# EAGLE design TeensyAcousticMappingShield (EAGLE 6.6.0)
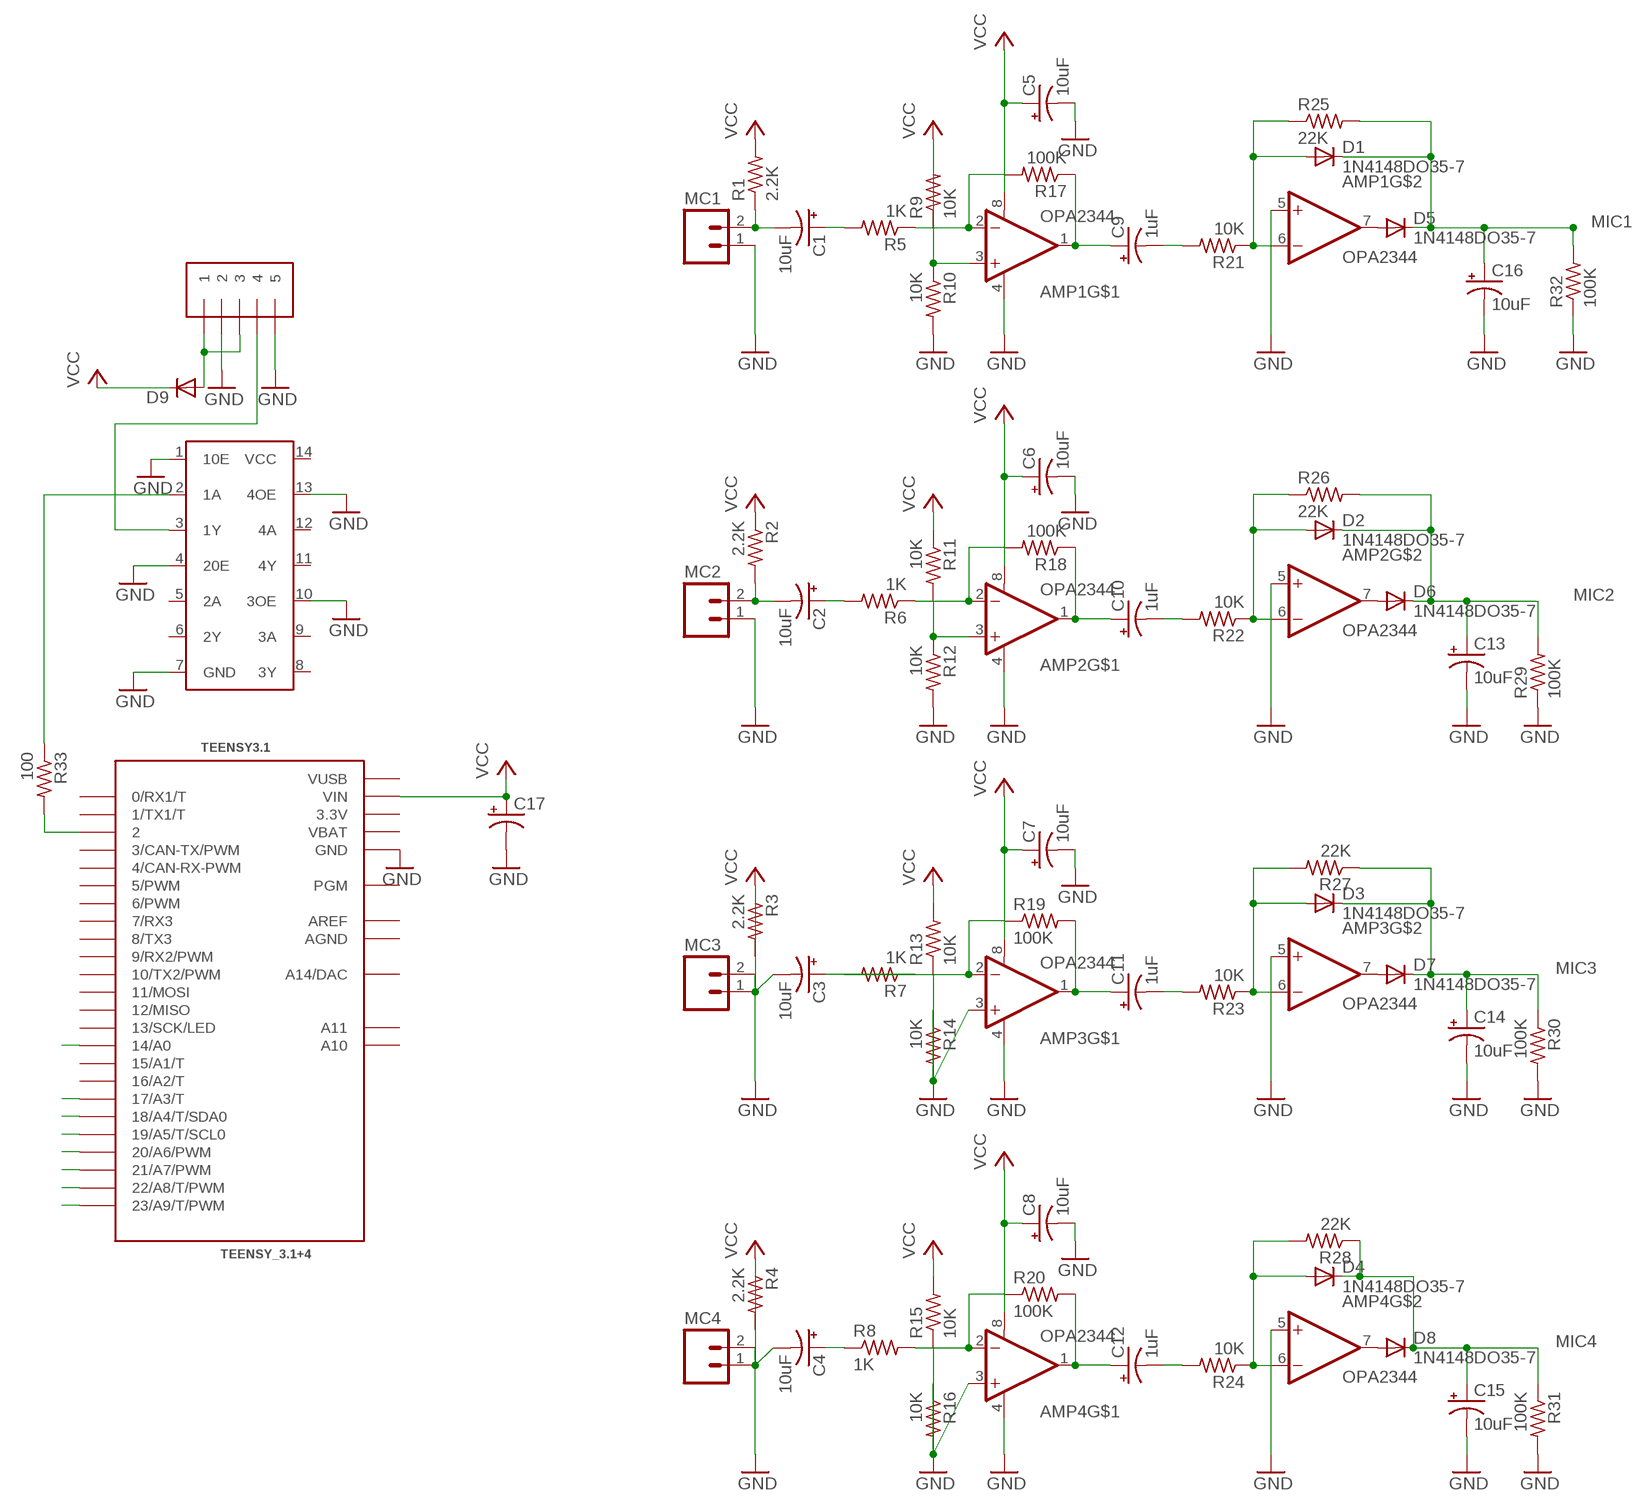
[diagram p0: schematic, sheet 1]

## Parts
AMP1  OPA2344  [DIP08]
AMP2  OPA2344  [DIP08]
AMP3  OPA2344  [DIP08]
AMP4  OPA2344  [DIP08]
C1  10uF  CPOL-USE2-4  [E2-4]
C2  10uF  CPOL-USE2-4  [E2-4]
C3  10uF  CPOL-USE2-4  [E2-4]
C4  10uF  CPOL-USE2-4  [E2-4]
C5  10uF  CPOL-USE2-4  [E2-4]
C6  10uF  CPOL-USE2-4  [E2-4]
C7  10uF  CPOL-USE2-4  [E2-4]
C8  10uF  CPOL-USE2-4  [E2-4]
C9  1uF  CPOL-USE2-4  [E2-4]
C10  1uF  CPOL-USE2-4  [E2-4]
C11  1uF  CPOL-USE2-4  [E2-4]
C12  1uF  CPOL-USE2-4  [E2-4]
C13  10uF  CPOL-USE2-4  [E2-4]
C14  10uF  CPOL-USE2-4  [E2-4]
C15  10uF  CPOL-USE2-4  [E2-4]
C16  10uF  CPOL-USE2-4  [E2-4]
C17  CPOL-USE2.5-6  [E2,5-6]
D1  1N4148DO35-7  [DO35-7]
D2  1N4148DO35-7  [DO35-7]
D3  1N4148DO35-7  [DO35-7]
D4  1N4148DO35-7  [DO35-7]
D5  1N4148DO35-7  [DO35-7]
D6  1N4148DO35-7  [DO35-7]
D7  1N4148DO35-7  [DO35-7]
D8  1N4148DO35-7  [DO35-7]
D9  DIODE-C1702-05  [C1702-05]
IO  1X5  [1X05-3.5MM]
LEVELSHIFT  74AHCT125  [DIL14]
MC1  M02LOCK_LONGPADS  [1X02_LOCK_LONGPADS]
MC2  M02LOCK_LONGPADS  [1X02_LOCK_LONGPADS]
MC3  M02LOCK_LONGPADS  [1X02_LOCK_LONGPADS]
MC4  M02LOCK_LONGPADS  [1X02_LOCK_LONGPADS]
R1  2.2K  R-US_0207/2V  [0207/2V]
R2  2.2K  R-US_0207/2V  [0207/2V]
R3  2.2K  R-US_0207/2V  [0207/2V]
R4  2.2K  R-US_0207/2V  [0207/2V]
R5  1K  R-US_0207/2V  [0207/2V]
R6  1K  R-US_0207/2V  [0207/2V]
R7  1K  R-US_0207/2V  [0207/2V]
R8  1K  R-US_0207/2V  [0207/2V]
R9  10K  R-US_0207/2V  [0207/2V]
R10  10K  R-US_0207/2V  [0207/2V]
R11  10K  R-US_0207/2V  [0207/2V]
R12  10K  R-US_0207/2V  [0207/2V]
R13  10K  R-US_0207/2V  [0207/2V]
R14  10K  R-US_0207/2V  [0207/2V]
R15  10K  R-US_0207/2V  [0207/2V]
R16  10K  R-US_0207/2V  [0207/2V]
R17  100K  R-US_0207/2V  [0207/2V]
R18  100K  R-US_0207/2V  [0207/2V]
R19  100K  R-US_0207/2V  [0207/2V]
R20  100K  R-US_0207/2V  [0207/2V]
R21  10K  R-US_0207/2V  [0207/2V]
R22  10K  R-US_0207/2V  [0207/2V]
R23  10K  R-US_0207/2V  [0207/2V]
R24  10K  R-US_0207/2V  [0207/2V]
R25  22K  R-US_0207/2V  [0207/2V]
R26  22K  R-US_0207/2V  [0207/2V]
R27  22K  R-US_0207/2V  [0207/2V]
R28  22K  R-US_0207/2V  [0207/2V]
R29  100K  R-US_0207/2V  [0207/2V]
R30  100K  R-US_0207/2V  [0207/2V]
R31  100K  R-US_0207/2V  [0207/2V]
R32  100K  R-US_0207/2V  [0207/2V]
R33  100  R-US_0207/2V  [0207/2V]
TEENSY3.1  TEENSY_3.1+4  [TEENSY_3.1+4]

## Nets
B+: D9.A IO.1 IO.3
GND: AMP1.4(V-) AMP1.5(+IN) AMP2.4(V-) AMP2.5(+IN) AMP3.4(V-) AMP3.5(+IN) AMP4.4(V-) AMP4.5(+IN) C5.- C6.- C7.- C8.- C13.- C14.- C15.- C16.- C17.- IO.2 IO.5 LEVELSHIFT.1(10E) LEVELSHIFT.4(20E) LEVELSHIFT.7(GND) LEVELSHIFT.10(3OE) LEVELSHIFT.13(4OE) MC1.1 MC2.1 MC3.2 MC4.2 R10.2 R12.2 R14.1 R16.1 R29.1 R32.1 TEENSY3.1.GND TEENSY3.1.GND1(GND)
MIC1: C16.+ D1.C D5.C R25.2 R32.2 TEENSY3.1.14/A0
MIC2: C13.+ D2.C D6.C R26.2 R29.2 TEENSY3.1.17/A3(17/A3/T)
MIC3: C14.+ D3.C D7.C R27.1 R30.1 TEENSY3.1.18/A4(18/A4/T/SDA0)
MIC4: C15.+ D4.C D8.C R28.1 R31.1 TEENSY3.1.19/A5(19/A5/T/SCL0)
N$1: AMP1.3(+IN) R9.2 R10.1
N$2: AMP1.2(-IN) R5.1 R17.2
N$3: AMP1.1(OUT) C9.+ R17.1
N$4: C1.+ R5.2
N$5: C1.- MC1.2 R1.1
N$6: C9.- R21.2
N$7: AMP1.6(-IN) D1.A R21.1 R25.1
N$8: AMP1.7(OUT) D5.A
N$9: AMP2.3(+IN) R11.2 R12.1
N$10: AMP2.2(-IN) R6.1 R18.2
N$11: AMP2.1(OUT) C10.+ R18.1
N$12: C2.+ R6.2
N$13: C2.- MC2.2 R2.2
N$14: C10.- R22.2
N$15: AMP2.6(-IN) D2.A R22.1 R26.1
N$16: AMP2.7(OUT) D6.A
N$17: AMP3.3(+IN) R13.1 R14.2
N$18: R33.2 TEENSY3.1.2
N$19: LEVELSHIFT.2(1A) R33.1
N$20: TEENSY3.1.20/A6(20/A6/PWM)
N$21: TEENSY3.1.21/A7(21/A7/PWM)
N$22: TEENSY3.1.22/A8(22/A8/T/PWM)
N$23: TEENSY3.1.23/A9(23/A9/T/PWM)
N$24: AMP3.2(-IN) R7.2 R19.1
N$25: AMP3.1(OUT) C11.+ R19.2
N$26: C3.+ R7.1
N$27: C3.- MC3.1 R3.1
N$28: C11.- R23.2
N$29: AMP3.6(-IN) D3.A R23.1 R27.2
N$30: AMP3.7(OUT) D7.A
N$31: AMP4.3(+IN) R15.1 R16.2
N$32: AMP4.2(-IN) R8.2 R20.1
N$33: AMP4.1(OUT) C12.+ R20.2
N$34: C4.+ R8.1
N$35: C4.- MC4.1 R4.1
N$36: C12.- R24.2
N$37: AMP4.6(-IN) D4.A R24.1 R28.2
N$38: AMP4.7(OUT) D8.A
N$41: IO.4 LEVELSHIFT.3(1Y)
VCC: AMP1.8(V+) AMP2.8(V+) AMP3.8(V+) AMP4.8(V+) C5.+ C6.+ C7.+ C8.+ C17.+ D9.C R1.2 R2.1 R3.2 R4.2 R9.1 R11.1 R13.2 R15.2 TEENSY3.1.VIN
Unconnected: LEVELSHIFT.5(2A) LEVELSHIFT.6(2Y) LEVELSHIFT.8(3Y) LEVELSHIFT.9(3A) LEVELSHIFT.11(4Y) LEVELSHIFT.12(4A) LEVELSHIFT.14(VCC) R30.2 R31.2 TEENSY3.1.0(0/RX1/T) TEENSY3.1.1(1/TX1/T) TEENSY3.1.3(3/CAN-TX/PWM) TEENSY3.1.4(4/CAN-RX-PWM) TEENSY3.1.5(5/PWM) TEENSY3.1.6(6/PWM) TEENSY3.1.7(7/RX3) TEENSY3.1.8(8/TX3) TEENSY3.1.9(9/RX2/PWM) TEENSY3.1.10(10/TX2/PWM) TEENSY3.1.11(11/MOSI) TEENSY3.1.12(12/MISO) TEENSY3.1.13(13/SCK/LED) TEENSY3.1.15/A1(15/A1/T) TEENSY3.1.16/A2(16/A2/T) TEENSY3.1.A10 TEENSY3.1.A11 TEENSY3.1.A14(A14/DAC) TEENSY3.1.PGM

## Power pins joined to a net without a drawn wire
3.3V: TEENSY3.1.3.3V TEENSY3.1.3.3V1(3.3V)
AGND: TEENSY3.1.AGND
AREF: TEENSY3.1.AREF
VBAT: TEENSY3.1.VBAT
VUSB: TEENSY3.1.VUSB

## Library data of the parts
AMP1-AMP4 = AcousticMappingParts:OPA2344: BurrBrown OPAmp
C1-C16 = resistor:CPOL-US: POLARIZED CAPACITOR, American symbol
C17 = adafruit:CPOL-US: POLARIZED CAPACITOR, American symbol
D1-D8 = diode:1N4148: DIODE high speed (Philips)
D9 = diode:DIODE-: DIODE
IO = adafruit:1X5
LEVELSHIFT = AcousticMappingParts:74AHCT125
MC1-MC4 = SparkFun-Connectors:M02: Header 2 Standard 2-pin 0.1" header. Use with straight break away headers (SKU : PRT-00116), right angle break away headers (PRT-00553), swiss pins (PRT-00743), machine pins (PRT-00117), and female headers (PRT-00115). Molex polarized connector foot print use with SKU : PRT-08233 with associated crimp pins and housings.
R1-R33 = adafruit:R-US_: RESISTOR, American symbol
TEENSY3.1 = Teensy_3_Series_Board_v1.0:TEENSY_3.1+4: Footprint for Teensy 3.1 board using all through-holes, i.e. the entire perimeter plus the 4 through-holes inboard (A10,A11,AREF, VUSB)

## Board
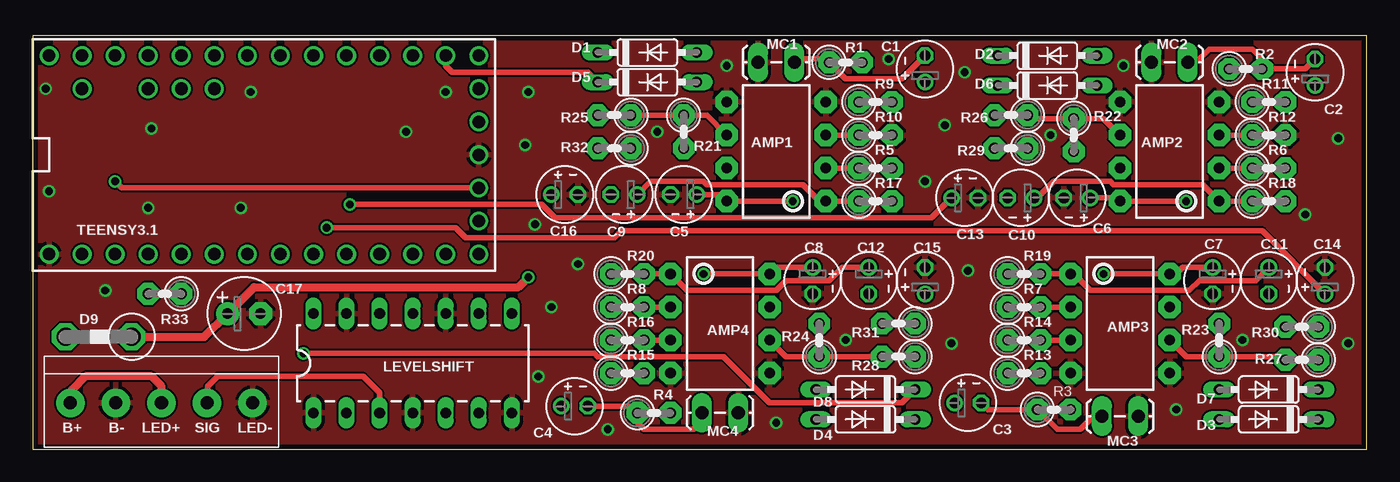
[diagram p1: board, top side]
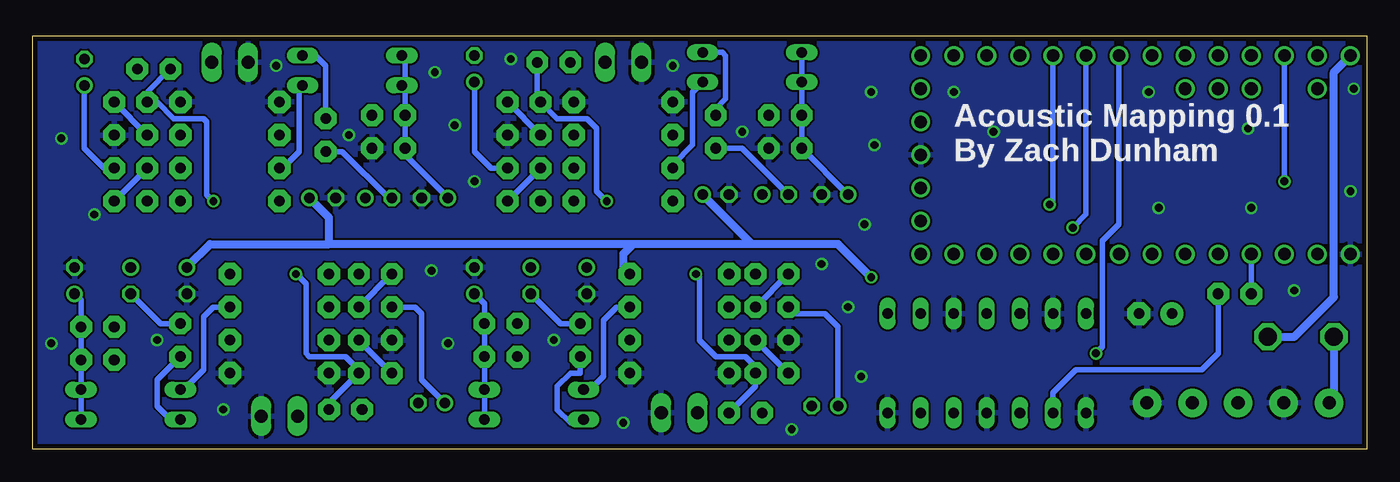
[diagram p2: board, bottom side, seen from below]

Size 102.54 x 31.75 mm. Coordinates in mm from the lower left corner, seen from the top.
Outline: 0,0 102.54,0 102.54,31.74 0.01,31.75 0,0
Copper layers (1*16): Top 0.0356mm / dielectric 1.5011mm / Bottom 0.0356mm
Design rules "OSHDRU": minimum track width 6mil, minimum drill 13mil, track to track 6mil, track to pad 6mil, pad to pad 6mil, via to via 6mil, smd to smd 6mil, copper to edge 15mil, drill to drill 6mil, minimum pad ring 7mil, minimum via ring 7mil, stop-mask expansion 3mil, vias tented up to drill 0mil, thermal gap 10mil

### Footprints (pad centres in the part's own frame; a part is rotated, then mirrored left to right if it is on the bottom)
DIP08 = drill 0.813 pad 1.727 octagon: 1 -3.81,-3.81; 2 -1.27,-3.81; 3 1.27,-3.81; 4 3.81,-3.81; 5 3.81,3.81; 6 1.27,3.81; 7 -1.27,3.81; 8 -3.81,3.81
E2-4 = drill 0.813 pad 1.27: + -1.016,0 | drill 0.813 pad 1.27 octagon: - 1.016,0
E2,5-6 = drill 0.813 pad 1.778: + -1.27,0 | drill 0.813 pad 1.778 octagon: - 1.27,0
DO35-7 = drill 0.813 long: A 3.81,0; C -3.81,0
C1702-05 = drill 1.397 octagon: A 2.54,0; C -2.54,0
1X05-3.5MM = drill 1 pad 2.184: 1 7,0; 2 3.5,0; 3 0,0; 4 -3.5,0; 5 -7,0
DIL14 = drill 0.813 long: 1 -8.89,-3.81; 2 -6.35,-3.81; 3 -3.81,-3.81; 4 -1.27,-3.81; 5 1.27,-3.81; 6 3.81,-3.81; 7 6.35,-3.81; 8 6.35,3.81; 9 3.81,3.81; 10 1.27,3.81; 11 -1.27,3.81; 12 -3.81,3.81; 13 -6.35,3.81; 14 -8.89,3.81
1X02_LOCK_LONGPADS = drill 1.016 long: 1 -0.127,0; 2 2.667,0
0207/2V = drill 0.813 pad 1.676 octagon: 1 -1.27,0; 2 1.27,0
TEENSY_3.1+4 = drill 0.965: 0 -7.62,15.24; 1 -7.62,12.7; 2 -7.62,10.16; 3 -7.62,7.62; 3.3V 7.62,12.7; 3.3V1 -2.54,-15.24; 4 -7.62,5.08; 5 -7.62,2.54; 6 -7.62,0; 7 -7.62,-2.54; 8 -7.62,-5.08; 9 -7.62,-7.62; 10 -7.62,-10.16; 11 -7.62,-12.7; 12 -7.62,-15.24; 13 7.62,-15.24; 14/A0 7.62,-12.7; 15/A1 7.62,-10.16; 16/A2 7.62,-7.62; 17/A3 7.62,-5.08; 18/A4 7.62,-2.54; 19/A5 7.62,0; 20/A6 7.62,2.54; 21/A7 7.62,5.08; 22/A8 7.62,7.62; 23/A9 7.62,10.16; A10 5.08,7.62; A11 5.08,5.08; A14 5.08,-15.24; AGND 7.62,15.24; AREF 5.08,10.16; GND -7.62,17.78; GND1 0,-15.24; PGM 2.54,-15.24; VBAT -5.08,-15.24; VIN 7.62,17.78; VUSB 5.08,15.24

### Placement (x,y rotation side)
AMP1  57.15,22.86 90 top
AMP2  87.38,22.86 90 top
AMP3  83.57,9.65 270 top
AMP4  52.83,9.65 270 top
C1  68.58,29.21 90 top
C2  98.55,28.96 90 top
C3  71.88,3.56 0 top
C4  41.66,3.3 0 top
C5  50.04,19.56 180 top
C6  80.26,19.3 180 top
C7  90.68,12.95 270 top
C8  59.94,12.95 270 top
C9  45.47,19.56 180 top
C10  75.95,19.3 180 top
C11  95,12.95 270 top
C12  64.26,12.95 270 top
C13  71.63,19.3 0 top
C14  99.31,12.95 90 top
C15  68.58,12.95 90 top
C16  40.89,19.56 0 top
C17  16.26,10.41 0 top
D1  47.24,30.48 0 top
D2  77.98,30.23 0 top
D3  95,2.29 180 top
D4  64.01,2.29 180 top
D5  47.24,28.19 0 top
D6  77.98,27.94 0 top
D7  95,4.57 180 top
D8  64.01,4.57 180 top
D9  5.08,8.64 180 top
IO  9.91,3.56 180 top
LEVELSHIFT  30.48,6.6 0 top
MC1  55.88,29.72 0 top
MC2  86.11,29.72 0 top
MC3  82.3,2.54 0 top
MC4  51.56,2.79 0 top
R1  62.48,29.72 0 top
R2  93.22,29.21 0 top
R3  78.49,3.05 0 top
R4  47.75,2.79 0 top
R5  64.77,21.59 0 top
R6  95,21.59 0 top
R7  76.2,10.92 0 top
R8  45.72,10.92 0 top
R9  64.77,26.67 0 top
R10  64.77,24.13 0 top
R11  95,26.67 0 top
R12  95,24.13 0 top
R13  76.2,5.84 0 top
R14  76.2,8.38 0 top
R15  45.72,5.84 0 top
R16  45.72,8.38 0 top
R17  64.77,19.05 0 top
R18  95,19.05 0 top
R19  76.2,13.46 0 top
R20  45.72,13.46 0 top
R21  50.04,24.38 270 top
R22  80.01,24.13 270 top
R23  91.19,8.38 90 top
R24  60.45,8.38 90 top
R25  44.7,25.65 180 top
R26  75.18,25.65 180 top
R27  97.54,6.86 180 top
R28  66.55,7.11 180 top
R29  75.18,23.11 180 top
R30  97.54,9.4 180 top
R31  66.55,9.65 180 top
R32  44.7,23.11 180 top
R33  10.16,11.94 180 top
TEENSY3.1  19.05,22.61 90 top

### Tracks (layer width: path | path; a pad name or v marks a point on that pad's centre or on a via)
3.3V  (via drill 0.6)
  Top 0.406: TEENSY3.1.3.3V1 6.86,20.07 v6.35,20.57
  Bottom 0.406: v6.35,20.57 TEENSY3.1.3.3V
B+
  Top 0.61: IO.3 9.91,4.83 9.14,5.59 4.06,5.59 3.05,4.57 3.05,3.7 IO.1
  Bottom 0.61: D9.A 2.54,3.92 IO.1
GND  (via drill 0.6)
  other vias: 65.79,29.97 70.1,24.89 68.58,20.57 71.88,13.72 70.61,8.13 100.33,23.88 97.79,18.03 38.61,17.27 41.91,14.22 38.86,5.59 39.88,10.92 37.85,23.37 38.1,27.43 31.75,27.43 28.7,24.38 16.76,27.43 1.02,27.69 1.27,19.81 9.14,24.64 8.89,18.54 16,18.54 5.59,12.19 87.88,3.05 101.09,8.13 83.82,29.46 53.34,29.46 48.01,24.38 78.23,24.13 92.96,8.38 62.48,8.38 57.15,2.03 44.2,1.52 71.63,28.96
  pour Top: 0,0.25 102.62,0.51 102.62,32 0,31.75
  pour Bottom: 0,0.25 102.62,0.51 102.62,32 0,31.75
MIC1
  Top 0.406: TEENSY3.1.14/A0 31.75,29.46 32.26,28.96 42.67,28.96 D5.C
  Bottom 0.406: D1.C D5.C R25.2 R32.2 C16.+
MIC2  (via drill 0.6)
  Top 0.406: C13.+ 69.09,17.78 40.13,17.78 39.12,18.8 33.78,18.8 33.27,18.8 v24.38,18.8
  Bottom 0.406: 73.91,28.19 R26.2 R29.2 73.91,22.61 C13.+ | D2.C 73.91,29.97 73.91,28.19 | 73.91,28.19 D6.C | TEENSY3.1.17/A3 24.13,19.05 v24.38,18.8
MIC3  (via drill 0.6)
  Top 0.406: v22.61,17.02 32.51,17.02 33.27,16.26 44.7,16.26 45.21,16.76 94.49,16.76 C14.+
  Bottom 0.406: C14.+ 98.81,11.43 R30.1 R27.1 D7.C D3.C | TEENSY3.1.18/A4 21.59,18.03 v22.61,17.02
MIC4  (via drill 0.6)
  Top 0.406: v20.83,7.37 43.18,7.37 43.43,7.11 53.09,7.11 56.64,3.56 66.8,3.56 D8.C
  Bottom 0.406: D4.C D8.C R28.1 R31.1 67.82,11.18 C15.+ | TEENSY3.1.19/A5 19.05,17.27 20.32,16 20.32,7.87 v20.83,7.37
N$1
  Top 0.406: R10.1 AMP1.3
  Bottom 0.406: R9.2 R10.1
N$2
  Top 0.406: R5.1 AMP1.2
  Bottom 0.406: R17.2 R5.1
N$3
  Top 0.406: R17.1 AMP1.1 60.45,19.05 59.18,20.32 51.82,20.32 51.56,20.57 47.5,20.57 C9.+
N$4
  Bottom 0.406: R5.2 67.31,21.59 68.58,22.86 C1.+
N$5
  Top 0.406: C1.- 66.8,28.45 62.48,28.45 R1.1 60.96,29.97 58.8,29.97 MC1.2
N$6
  Bottom 0.406: R21.2 48.01,23.11 C9.-
N$7
  Top 0.406: R25.1 R21.1 51.82,25.65 AMP1.6
  Bottom 0.406: R21.1 50.04,26.16 49.28,26.92 49.28,30.23 49.53,30.48 D1.A
N$8
  Bottom 0.406: AMP1.7 53.34,21.84 51.82,23.37 51.82,27.43 D5.A
N$9
  Top 0.406: R12.1 AMP2.3
  Bottom 0.406: R12.1 R11.2
N$10
  Top 0.406: R6.1 AMP2.2
  Bottom 0.406: R6.1 R18.2
N$11
  Top 0.406: R18.1 AMP2.1 89.92,20.32 83.06,20.32 82.8,20.57 78.49,20.57 77.22,19.3 C10.+
N$12
  Bottom 0.406: R6.2 97.03,21.59 98.55,23.11 C2.+
N$13
  Top 0.406: C2.- 97.79,29.21 R2.2 94.49,29.97 93.73,30.73 90.42,30.73 89.41,29.72 MC2.2
N$14
  Bottom 0.406: C10.- 75.18,19.3 78.74,22.86 R22.2
N$15
  Top 0.406: AMP2.6 82.3,25.4 R22.1 76.71,25.4 R26.1
  Bottom 0.406: R22.1 80.01,29.46 80.77,30.23 D2.A
N$16
  Bottom 0.406: AMP2.7 83.31,21.59 82.04,22.86 82.04,27.69 D6.A
N$17
  Top 0.406: R14.2 AMP3.3
  Bottom 0.406: R13.1 R14.2
N$18
  Bottom 0.406: R33.2 TEENSY3.1.2
N$19
  Bottom 0.406: R33.1 11.43,7.37 12.7,6.1 22.35,6.1 24.13,4.32 LEVELSHIFT.2
N$24
  Top 0.406: AMP3.2 R7.2
  Bottom 0.406: R7.2 R19.1
N$25
  Top 0.406: R19.2 AMP3.1 80.01,13.46 81.28,12.19 88.9,12.19 89.66,12.95 93.98,12.95 C11.+
N$26
  Bottom 0.406: R7.1 73.15,10.92 72.64,10.41 72.64,5.33 C3.+
N$27
  Top 0.406: MC3.1 81.53,2.54 80.52,1.52 78.74,1.52 R3.1 73.41,3.05 C3.-
N$28
  Bottom 0.406: R23.2 92.71,9.65 C11.-
N$29
  Top 0.406: AMP3.6 88.65,7.11 R23.1 96.01,7.11 R27.2
  Bottom 0.406: D3.A 91.95,2.29 92.96,3.3 92.96,5.33 R23.1
N$30
  Bottom 0.406: D7.A 90.93,4.57 89.41,6.1 89.41,10.16 88.65,10.92 AMP3.7
N$31
  Top 0.406: R16.2 AMP4.3
  Bottom 0.406: R15.1 R16.2
N$32
  Top 0.406: R8.2 AMP4.2
  Bottom 0.406: R20.1 R8.2
N$33
  Top 0.406: C12.+ 62.23,13.97 61.21,12.95 57.91,12.95 57.15,12.19 50.29,12.19 AMP4.1 R20.2
N$34
  Bottom 0.406: 44.45,10.41 R8.1 43.94,10.41 41.66,10.41 40.64,9.4 C4.+
N$35
  Top 0.406: MC4.1 51.31,2.67 51.31,2.03 50.8,1.52 46.99,1.52 46.48,2.03 R4.1 45.97,3.3 C4.-
N$36
  Bottom 0.406: R24.2 61.98,9.65 C12.-
N$37
  Top 0.406: R28.2 R24.1 57.91,7.11 AMP4.6
  Bottom 0.406: R24.1 60.45,5.84 61.21,5.84 62.23,4.83 62.23,3.05 61.21,2.03 60.45,2.03 D4.A
N$38
  Bottom 0.406: D8.A 59.69,4.57 58.67,5.59 58.67,9.91 57.66,10.92 AMP4.7
N$41
  Top 0.406: LEVELSHIFT.3 26.67,4.32 25.4,5.59 14.22,5.59 13.46,4.83 13.46,3.61 IO.4
VCC  (via drill 0.6)
  Top 0.406: C8.+ 57.15,13.97 AMP4.8 v51.56,13.46 | v82.3,13.46 AMP3.8 87.88,13.46 88.39,13.97 C7.+ | v88.65,19.05 AMP2.8 83.31,19.3 C6.+ | v58.42,19.05 AMP1.8 52.83,19.56 C5.+
  Top 0.61: v38.1,13.21 37.34,12.45 17.02,12.45 C17.+ 13.21,8.64 D9.C
  Bottom 0.406: R4.2 46.99,4.83 R15.2 46.99,6.35 47.75,7.11 50.04,7.11 51.31,8.38 51.31,13.21 v51.56,13.46 | R3.2 79.76,3.56 R13.2 77.47,6.1 78.49,7.11 81.28,7.11 81.53,7.37 81.53,12.7 v82.3,13.46 | R2.1 93.73,27.43 R11.1 92.96,26.67 91.69,25.4 89.41,25.4 89.15,25.15 89.15,19.56 v88.65,19.05 | R1.2 63.75,26.92 R9.1 62.23,25.4 59.94,25.4 59.18,24.64 59.18,19.81 v58.42,19.05
  Bottom 0.61: v38.1,13.21 40.64,15.75 47.24,15.75 | 47.24,15.75 56.39,15.75 | 56.39,15.75 79.76,15.75 | C7.+ 88.9,15.75 79.76,15.75 | 79.76,15.75 79.76,17.78 C6.+ | 47.24,15.75 C5.+ | 56.39,15.75 57.15,14.99 57.15,13.97 AMP4.8 | D9.C 5.59,8.64 2.54,11.68 2.54,28.96 TEENSY3.1.VIN

### Text on the board
bPlace: Acoustic Mapping 0.1 / By Zach Dunham
tNames: B+ | B- | LED+ | SIG | LED-